# EAGLE design JTAG adapter (EAGLE 6.3)
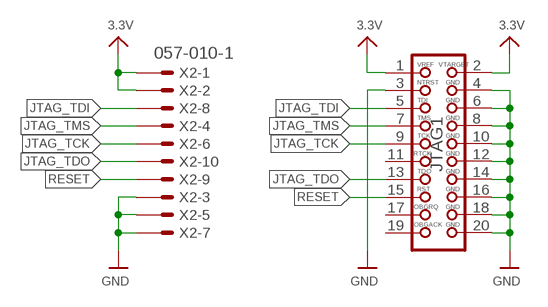
[diagram p0: schematic, sheet 1]

## Parts
JTAG1  JTAG-ARM  [JTAG-ARM]
X2  057-010-1  [057-010-1]

## Nets
3.3V: JTAG1.1 JTAG1.2 X2.1 X2.2
GND: JTAG1.3 JTAG1.4 JTAG1.6 JTAG1.8 JTAG1.10 JTAG1.12 JTAG1.14 JTAG1.16 JTAG1.18 JTAG1.20 X2.3 X2.5 X2.7
JTAG_TCK: JTAG1.9 X2.6
JTAG_TDI: JTAG1.5 X2.8
JTAG_TDO: JTAG1.13 X2.10
JTAG_TMS: JTAG1.7 X2.4
RESET: JTAG1.15 X2.9
Unconnected: JTAG1.11 JTAG1.17 JTAG1.19

## Library data of the parts
JTAG1 = microbuilder:JTAG-ARM: 20 Pin JTAG Connector For use with ARM7, and ARM9. Supported by some Cortex M3 boards with SWJ-DP interfaces (dual SWP/JTAG support). 4UConnector: 03556
X2 = con-panduit:057-010-: CONNECTOR 10-pin series 057 contact pc board low profile headers; OC_FARNELL: unknown; OC_NEWARK: unknown

## Board
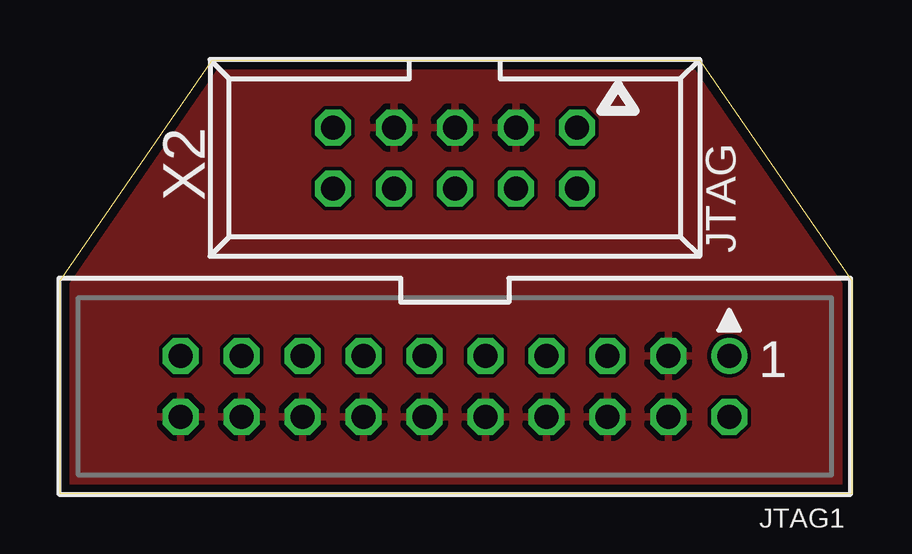
[diagram p1: board, top side]
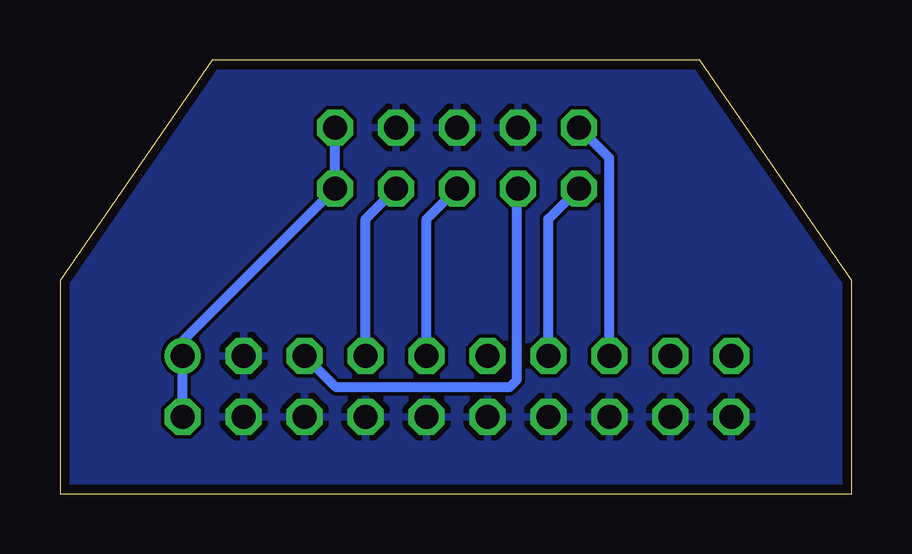
[diagram p2: board, bottom side, seen from below]

Size 33.02 x 18.1 mm. Coordinates in mm from the lower left corner, seen from the top.
Outline: 0,0 0,8.89 6.35,18.1 26.67,18.1 33.02,8.89 33.02,0 0,0
Copper layers (1*16): Top 0.0356mm / dielectric 1.5011mm / Bottom 0.0356mm
Design rules "LaenPCBOrder *": minimum track width 6mil, minimum drill 13mil, track to track 6mil, track to pad 6mil, pad to pad 6mil, via to via 6mil, smd to smd 6mil, copper to edge 15mil, drill to drill 6mil, minimum pad ring 7mil, minimum via ring 7mil, stop-mask expansion 3mil, vias tented up to drill 0mil, thermal gap 10mil

### Footprints (pad centres in the part's own frame; a part is rotated, then mirrored left to right if it is on the bottom)
JTAG-ARM = drill 1: 1 -11.43,-1.27 | drill 1 octagon: 2 -11.43,1.27; 3 -8.89,-1.27; 4 -8.89,1.27; 5 -6.35,-1.27; 6 -6.35,1.27; 7 -3.81,-1.27; 8 -3.81,1.27; 9 -1.27,-1.27; 10 -1.27,1.27; 11 1.27,-1.27; 12 1.27,1.27; 13 3.81,-1.27; 14 3.81,1.27; 15 6.35,-1.27; 16 6.35,1.27; 17 8.89,-1.27; 18 8.89,1.27; 19 11.43,-1.27; 20 11.43,1.27
057-010-1 = drill 1 octagon: 1 -5.08,-1.27; 2 -5.08,1.27; 3 -2.54,-1.27; 4 -2.54,1.27; 5 0,-1.27; 6 0,1.27; 7 2.54,-1.27; 8 2.54,1.27; 9 5.08,-1.27; 10 5.08,1.27

### Placement (x,y rotation side)
JTAG1  16.47,4.49 180 top
X2  16.46,14.01 180 top

### Tracks (layer width: path | path; a pad name or v marks a point on that pad's centre or on a via)
3.3V
  Bottom 0.406: JTAG1.2 JTAG1.1 27.9,6.39 X2.2 X2.1
GND
  pour Top: 0,0 0,8.89 6.35,18.1 26.67,18.1 33.02,8.89 33.02,0
  pour Bottom: 0,0 0,8.89 6.35,18.1 26.67,18.1 33.02,8.89 33.02,0
JTAG_TCK
  Bottom 0.406: JTAG1.9 17.74,11.47 X2.6
JTAG_TDI
  Bottom 0.406: X2.8 13.97,12.7 13.97,4.76 14.29,4.45 21.5,4.45 JTAG1.5
JTAG_TDO
  Bottom 0.406: JTAG1.13 12.66,11.47 X2.10
JTAG_TMS
  Bottom 0.406: JTAG1.7 20.28,11.47 X2.4
RESET
  Bottom 0.406: JTAG1.15 10.12,14.01 X2.9

### Text on the board
tSilk: JTAG